# Altium schematic sheet YA-N-Block.SchDoc: Yet Another IoT Node - Blocks
size A4; Revision: 2.0; SheetNumber: 1; SheetTotal: 5
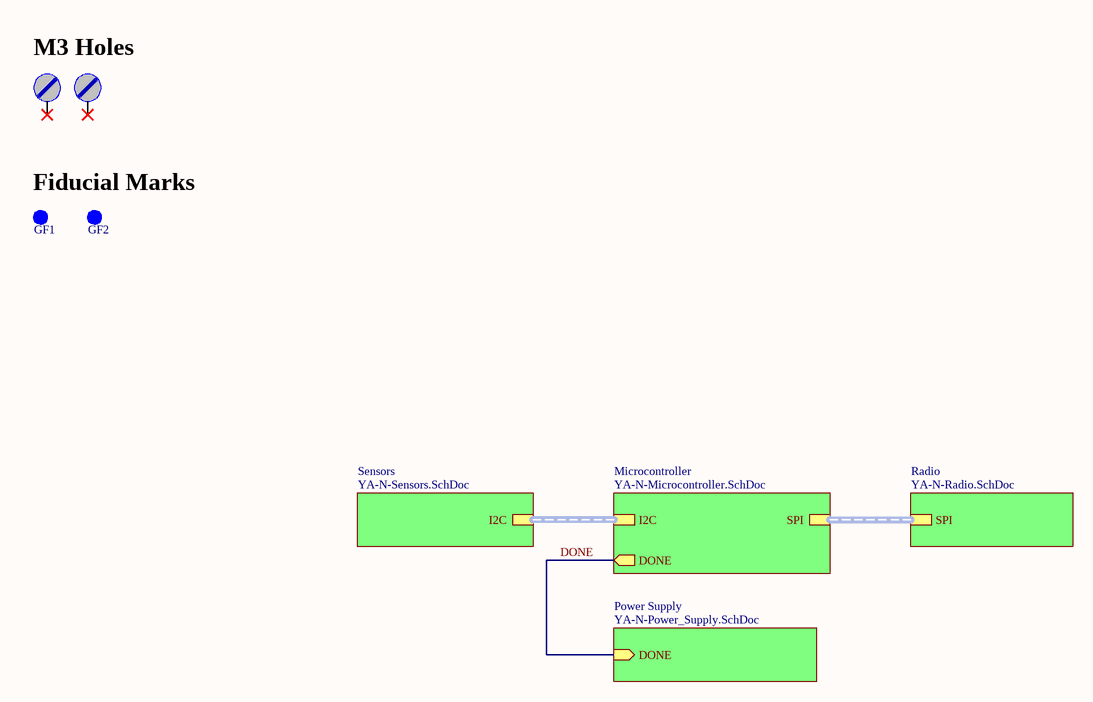
[diagram p0: YA-N-Block.SchDoc]

## Parts
GF1  Fiducial  [FIDUCIAL]  (value not drawn)  (no BOM)
GF2  Fiducial  [FIDUCIAL]  (value not drawn)  (no BOM)
M1  Furo de Fixação  [Furo_M3]  (value not drawn)  (no BOM)
M2  Furo de Fixação  [Furo_M3]  (value not drawn)  (no BOM)

## Sub-sheets
Microcontroller = YA-N-Microcontroller.SchDoc: I2C (harness I2C), SPI (harness SPI), DONE (out)
Power Supply = YA-N-Power_Supply.SchDoc: DONE (in)
Radio = YA-N-Radio.SchDoc: SPI (harness SPI)
Sensors = YA-N-Sensors.SchDoc: I2C (harness I2C)

## Nets
DONE: sheet Microcontroller/DONE, sheet Power Supply/DONE

Not connected (* = marked no-connect by the designer): M1 X*; M2 X*

## Buses and harness runs
harness sheet Microcontroller/I2C = sheet Sensors/I2C
harness sheet Microcontroller/SPI = sheet Radio/SPI

## Notes on the sheet
- M3 Holes
- Fiducial Marks
- Projeto:
- Tamanho:
- Data:
- A4
- Eng. Felipe Navarro
- Hora:
- Revisão:
- Folha
- de
- Arquivo:

## Library data of the parts
GF1 GF2 = Fiducial: Guia Fiducial; ChinesePrice: 0,00000; Chinês: ----; Corrente: *; Potência: *; Supplier 1: Digi-Key; Supplier Part Number 1: --Del; Tensão: *; Value: *; Obs:: *; Tolerância: *; ComponentLink1Description: Datasheet; ComponentLink1URL: D:\Tecnoclade\Datasheet\
M1 M2 = Parafuso: Furo para parafuso; Value: M3; ChinesePrice: 0,00000; Chinês: ----; Supplier 1: Digi-Key; Supplier Part Number 1: --Del; Corrente: *; Potência: *; Tensão: *; Tolerância: *; Obs:: *; ComponentLink1Description: Datasheet; ComponentLink1URL: D:\Tecnoclade\Datasheet\!DataMissing.pdf